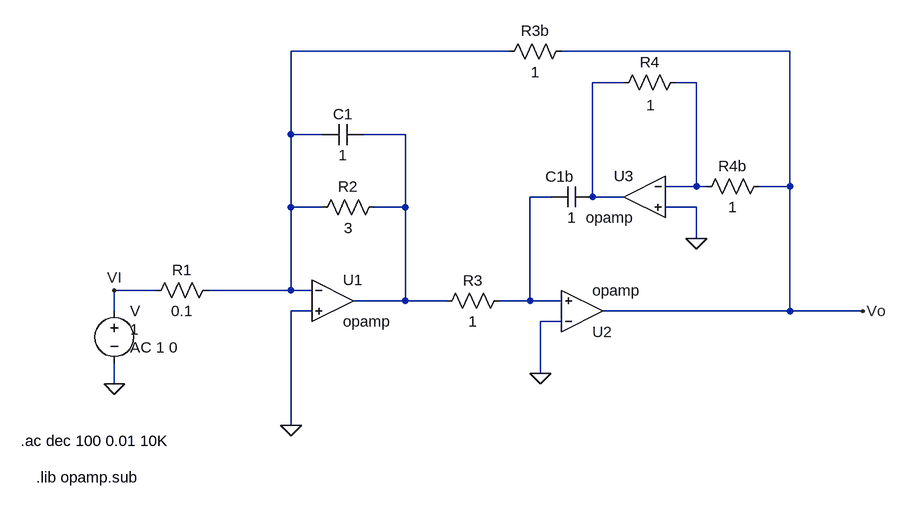
[diagram p0: schematic TS2.asc]
TS2.asc, the LTspice schematic file:
Version 4
SHEET 1 1172 680
WIRE 496 -208 160 -208
WIRE 928 -208 576 -208
WIRE 672 -160 624 -160
WIRE 784 -160 752 -160
WIRE 160 -80 160 -208
WIRE 208 -80 160 -80
WIRE 336 -80 272 -80
WIRE 784 0 784 -160
WIRE 784 0 736 0
WIRE 800 0 784 0
WIRE 928 0 928 -208
WIRE 928 0 880 0
WIRE 560 16 528 16
WIRE 624 16 624 -160
WIRE 672 16 624 16
WIRE 160 32 160 -80
WIRE 208 32 160 32
WIRE 336 32 336 -80
WIRE 336 32 288 32
WIRE 784 32 736 32
WIRE 784 80 784 32
WIRE -48 160 -112 160
WIRE 160 160 160 32
WIRE 160 160 32 160
WIRE 192 160 160 160
WIRE 336 176 336 32
WIRE 336 176 256 176
WIRE 400 176 336 176
WIRE 528 176 528 16
WIRE 528 176 480 176
WIRE 576 176 528 176
WIRE -112 192 -112 160
WIRE 192 192 160 192
WIRE 928 192 928 0
WIRE 928 192 640 192
WIRE 1040 192 928 192
WIRE 576 208 544 208
WIRE 544 288 544 208
WIRE -112 304 -112 272
WIRE 160 368 160 192
FLAG 160 368 0
FLAG -112 304 0
FLAG 544 288 0
FLAG -112 160 VI
FLAG 784 80 0
FLAG 1040 192 Vo
SYMBOL res 48 144 R90
WINDOW 0 0 56 VBottom 2
WINDOW 3 32 56 VTop 2
SYMATTR InstName R1
SYMATTR Value 0.1
SYMBOL res 304 16 R90
WINDOW 0 0 56 VBottom 2
WINDOW 3 32 56 VTop 2
SYMATTR InstName R2
SYMATTR Value 3
SYMBOL cap 272 -96 R90
WINDOW 0 0 32 VBottom 2
WINDOW 3 32 32 VTop 2
SYMATTR InstName C1
SYMATTR Value 1
SYMBOL voltage -112 176 R0
WINDOW 3 24 44 Left 2
WINDOW 123 24 72 Left 2
WINDOW 39 0 0 Left 0
SYMATTR Value 1
SYMATTR Value2 AC 1 0
SYMATTR InstName V
SYMBOL res 496 160 R90
WINDOW 0 0 56 VBottom 2
WINDOW 3 32 56 VTop 2
SYMATTR InstName R3
SYMATTR Value 1
SYMBOL res 592 -224 R90
WINDOW 0 0 56 VBottom 2
WINDOW 3 32 56 VTop 2
SYMATTR InstName R3b
SYMATTR Value 1
SYMBOL cap 624 0 R90
WINDOW 0 0 50 VBottom 2
WINDOW 3 32 32 VTop 2
SYMATTR InstName C1b
SYMATTR Value 1
SYMBOL res 768 -176 R90
WINDOW 0 0 56 VBottom 2
WINDOW 3 35 54 VTop 2
SYMATTR InstName R4
SYMATTR Value 1
SYMBOL res 896 -16 R90
WINDOW 0 0 56 VBottom 2
WINDOW 3 32 56 VTop 2
SYMATTR InstName R4b
SYMATTR Value 1
SYMBOL OpAmps\\opamp 224 112 R0
SYMATTR InstName U1
SYMBOL OpAmps\\opamp 608 256 M180
SYMATTR InstName U2
SYMBOL OpAmps\\opamp 704 -48 M0
SYMATTR InstName U3
TEXT -256 392 Left 2 !.ac dec 100 0.01 10K
TEXT -232 448 Left 2 !.lib opamp.sub

The netlist it stands for:
* TS2.asc
R1 N001 VI 0.1
R2 N004 N001 3
C1 N004 N001 1
V VI 0 1 AC 1 0
R3 N005 N004 1
R3b Vo N001 1
C1b N002 N005 1
R4 N003 N002 1
R4b Vo N003 1
XU1 N001 0 N004 opamp Aol=100K GBW=10Meg  ; pins invin noninvin out
XU2 0 N005 Vo opamp Aol=100K GBW=10Meg  ; pins invin noninvin out
XU3 N003 0 N002 opamp Aol=100K GBW=10Meg  ; pins invin noninvin out
.ac dec 100 0.01 10K
.lib opamp.sub
.backanno
.end